# EAGLE design usb2cmi_s3_disp (EAGLE 6.5.0)
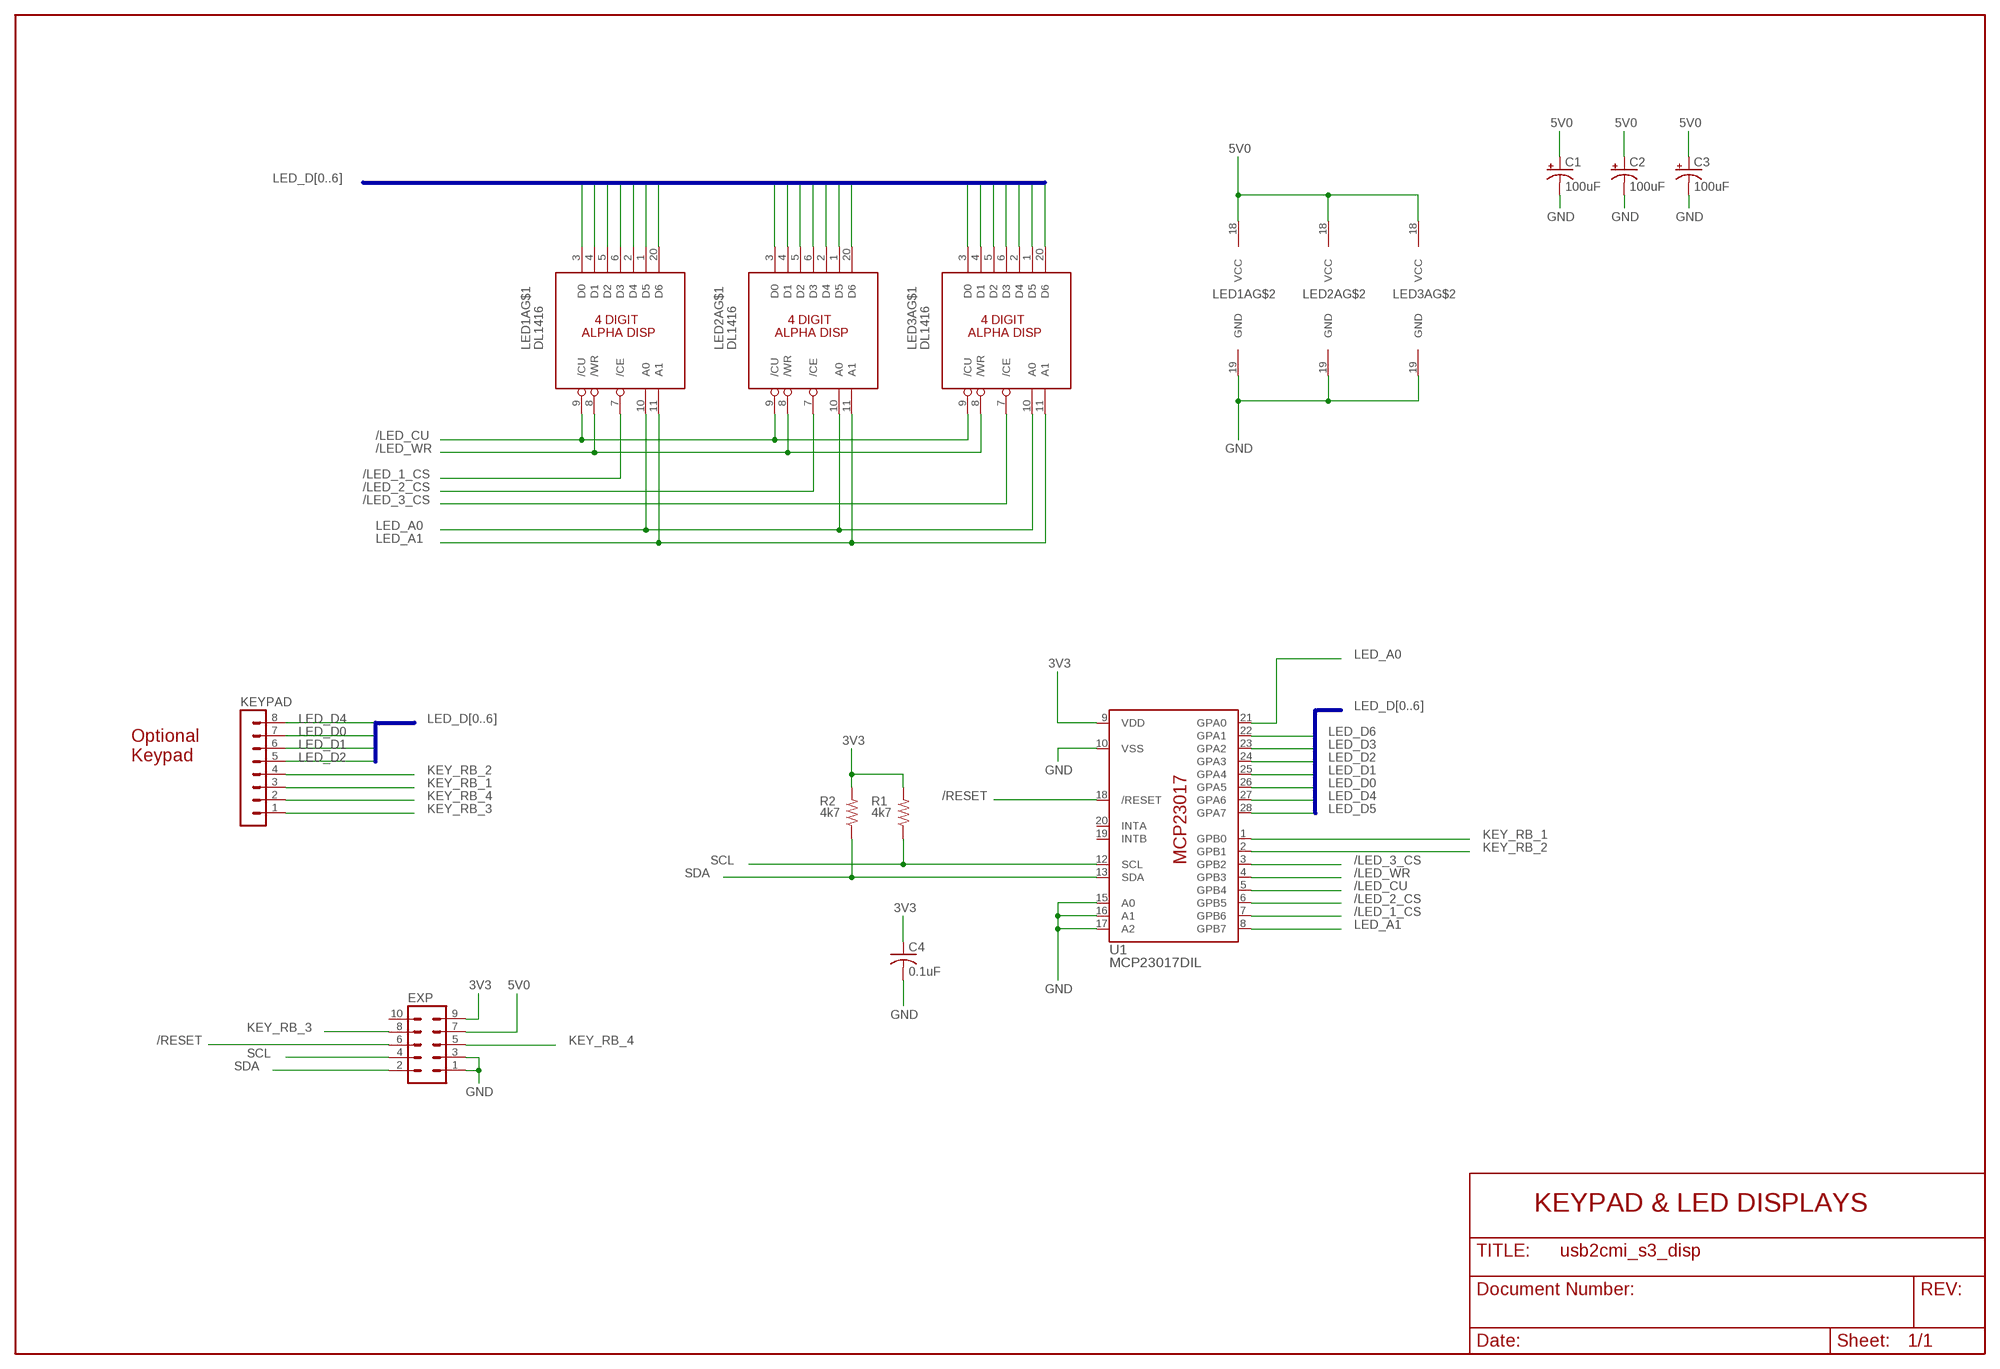
[diagram p0: schematic, sheet 1]

## Parts
C1  100uF  CPOL-USE2.5-7  [E2,5-7]
C2  100uF  CPOL-USE2.5-7  [E2,5-7]
C3  100uF  CPOL-USE2.5-7  [E2,5-7]
C4  0.1uF  C-US050-025X075  [C050-025X075]
EXP  MA05-2  [MA05-2]
KEYPAD  MA08-1  [MA08-1]
LED1A  DL1416  [DIL20]
LED2A  DL1416  [DIL20]
LED3A  DL1416  [DIL20]
R1  4k7  R-US_0207/10  [0207/10]
R2  4k7  R-US_0207/10  [0207/10]
U1  MCP23017DIL  [DIL28-3]

## Nets
3V3: C4.1 EXP.9 R1.2 R2.2 U1.9(VDD)
5V0: C1.+ C2.+ C3.+ EXP.7 LED1A.18(VCC) LED2A.18(VCC) LED3A.18(VCC)
/LED_1_CS: LED1A.7(/CE) U1.7(GPB6)
/LED_2_CS: LED2A.7(/CE) U1.6(GPB5)
/LED_3_CS: LED3A.7(/CE) U1.3(GPB2)
/LED_CU: LED1A.9(/CU) LED2A.9(/CU) LED3A.9(/CU) U1.5(GPB4)
/LED_WR: LED1A.8(/WR) LED2A.8(/WR) LED3A.8(/WR) U1.4(GPB3)
/RESET: EXP.6 U1.18(/RESET)
GND: C1.- C2.- C3.- C4.2 EXP.1 EXP.3 LED1A.19(GND) LED2A.19(GND) LED3A.19(GND) U1.10(VSS) U1.15(A0) U1.16(A1) U1.17(A2)
KEY_RB_1: KEYPAD.3 U1.1(GPB0)
KEY_RB_2: KEYPAD.4 U1.2(GPB1)
KEY_RB_3: EXP.8 KEYPAD.1
KEY_RB_4: EXP.5 KEYPAD.2
LED_A0: LED1A.10(A0) LED2A.10(A0) LED3A.10(A0) U1.21(GPA0)
LED_A1: LED1A.11(A1) LED2A.11(A1) LED3A.11(A1) U1.8(GPB7)
LED_D0: KEYPAD.7 LED1A.3(D0) LED2A.3(D0) LED3A.3(D0) U1.26(GPA5)
LED_D1: KEYPAD.6 LED1A.4(D1) LED2A.4(D1) LED3A.4(D1) U1.25(GPA4)
LED_D2: KEYPAD.5 LED1A.5(D2) LED2A.5(D2) LED3A.5(D2) U1.24(GPA3)
LED_D3: LED1A.6(D3) LED2A.6(D3) LED3A.6(D3) U1.23(GPA2)
LED_D4: KEYPAD.8 LED1A.2(D4) LED2A.2(D4) LED3A.2(D4) U1.27(GPA6)
LED_D5: LED1A.1(D5) LED2A.1(D5) LED3A.1(D5) U1.28(GPA7)
LED_D6: LED1A.20(D6) LED2A.20(D6) LED3A.20(D6) U1.22(GPA1)
SCL: EXP.4 R1.1 U1.12(SCL)
SDA: EXP.2 R2.1 U1.13(SDA)
Unconnected: EXP.10 U1.19(INTB) U1.20(INTA)

## Buses
LED_D[0..6]

## Notes on the sheet
- Optional
  Keypad
- KEYPAD & LED DISPLAYS

## Library data of the parts
C1-C3 = rcl:CPOL-US: POLARIZED CAPACITOR, American symbol
C4 = rcl:C-US: CAPACITOR, American symbol
EXP = con-lstb:MA05-2: PIN HEADER; OC_FARNELL: unknown; OC_NEWARK: unknown
KEYPAD = con-lstb:MA08-1: PIN HEADER; OC_FARNELL: unknown; OC_NEWARK: unknown
LED1A LED2A LED3A = led-siemens:DL1416
R1 R2 = rcl:R-US_: RESISTOR, American symbol
U1 = microchip-23016:MCP23017

## Board
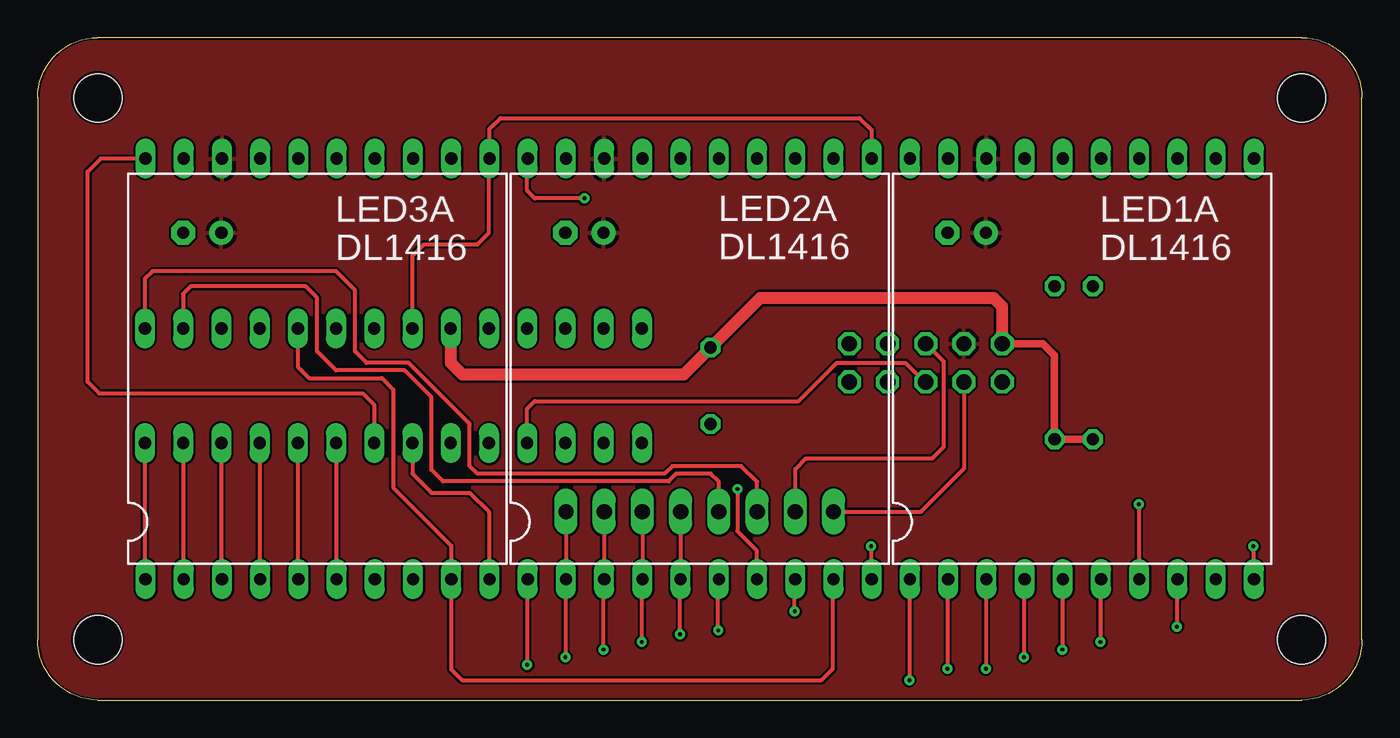
[diagram p1: board, top side]
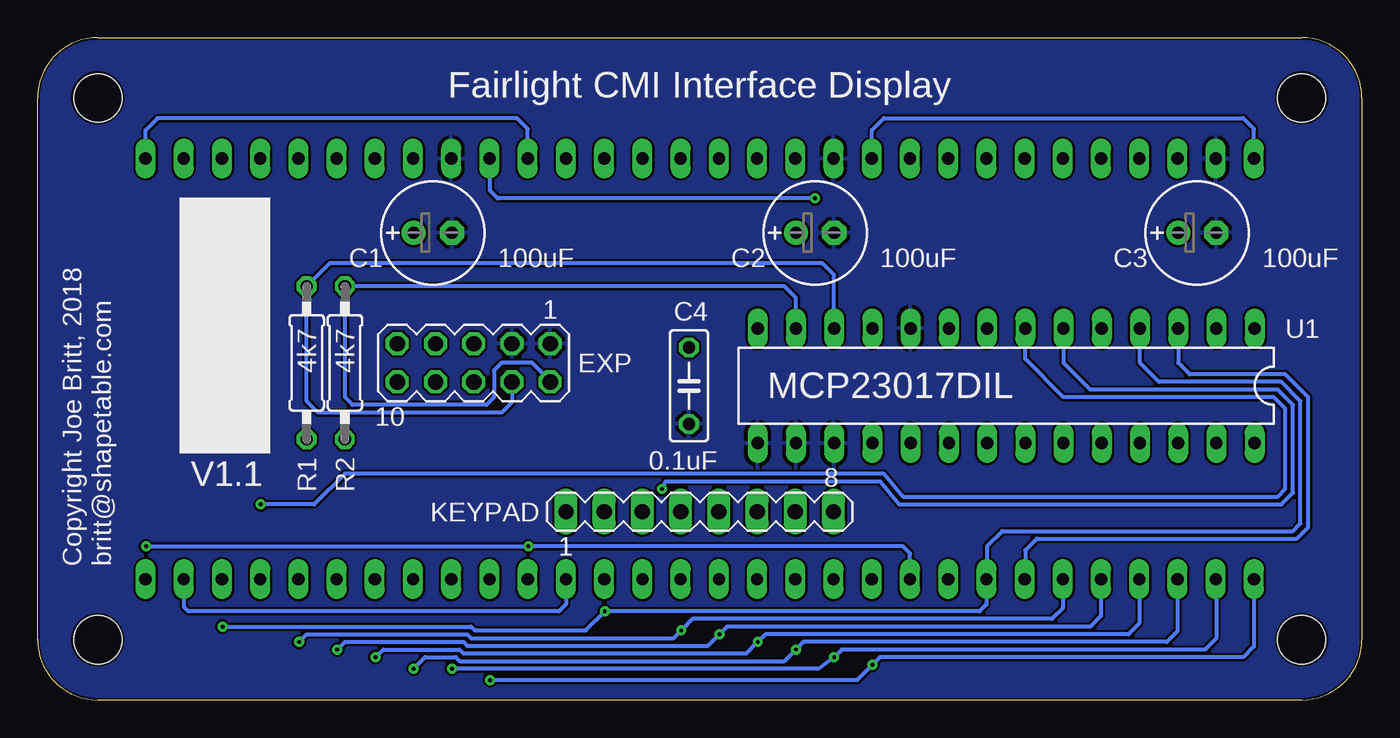
[diagram p2: board, bottom side, seen from below]

Size 88 x 44 mm. Coordinates in mm from the lower left corner, seen from the top.
Outline: 4,0 84,0 arc90 88,4 88,40 arc90 84,44 4,44 arc90 0,40 0,4 arc90 4,0
Copper layers (1*16): Top 0.035mm / dielectric 1.5mm / Bottom 0.035mm
Design rules "default *": minimum track width 6mil, minimum drill 10mil, track to track 6mil, track to pad 6mil, pad to pad 6mil, via to via 6mil, smd to smd 6mil, copper to edge 6mil, drill to drill 6mil, minimum pad ring 10mil, minimum via ring 8mil, stop-mask expansion 4mil, vias tented up to drill 10mil, thermal gap 10mil
Holes 3.2 mm at 4,40 84,40 84,4 4,4

### Footprints (pad centres in the part's own frame; a part is rotated, then mirrored left to right if it is on the bottom)
E2,5-7 = drill 0.813 pad 1.6: + -1.27,0 | drill 0.813 pad 1.6 octagon: - 1.27,0
C050-025X075 = drill 0.813 octagon: 1 -2.54,0; 2 2.54,0
MA05-2 = drill 1.016 octagon: 1 -5.08,-1.27; 2 -5.08,1.27; 3 -2.54,-1.27; 4 -2.54,1.27; 5 0,-1.27; 6 0,1.27; 7 2.54,-1.27; 8 2.54,1.27; 9 5.08,-1.27; 10 5.08,1.27
MA08-1 = drill 1.016 long: 1 -8.89,0; 2 -6.35,0; 3 -3.81,0; 4 -1.27,0; 5 1.27,0; 6 3.81,0; 7 6.35,0; 8 8.89,0
DIL20 = drill 0.813 long: 1 -11.43,-13.97; 2 -8.89,-13.97; 3 -6.35,-13.97; 4 -3.81,-13.97; 5 -1.27,-13.97; 6 1.27,-13.97; 7 3.81,-13.97; 8 6.35,-13.97; 9 8.89,-13.97; 10 11.43,-13.97; 11 11.43,13.97; 12 8.89,13.97; 13 6.35,13.97; 14 3.81,13.97; 15 1.27,13.97; 16 -1.27,13.97; 17 -3.81,13.97; 18 -6.35,13.97; 19 -8.89,13.97; 20 -11.43,13.97
0207/10 = drill 0.813 octagon: 1 -5.08,0; 2 5.08,0
DIL28-3 = drill 0.813 long: 1 -15.24,-3.81; 2 -12.7,-3.81; 3 -10.16,-3.81; 4 -7.62,-3.81; 5 -5.08,-3.81; 6 -2.54,-3.81; 7 0,-3.81; 8 2.54,-3.81; 9 5.08,-3.81; 10 7.62,-3.81; 11 10.16,-3.81; 12 12.7,-3.81; 13 15.24,-3.81; 14 17.78,-3.81; 15 17.78,3.81; 16 15.24,3.81; 17 12.7,3.81; 18 10.16,3.81; 19 7.62,3.81; 20 5.08,3.81; 21 2.54,3.81; 22 0,3.81; 23 -2.54,3.81; 24 -5.08,3.81; 25 -7.62,3.81; 26 -10.16,3.81; 27 -12.7,3.81; 28 -15.24,3.81

### Placement (x,y rotation side)
C1  61.74,31.04 0 bottom
C2  36.34,31.04 0 bottom
C3  10.94,31.04 0 bottom
C4  44.72,20.88 270 bottom
EXP  59.02,22.4 180 bottom
KEYPAD  44,12.51 0 bottom
LED1A  69.4,22 0 top
LED2A  44,22 0 top
LED3A  18.6,22 0 top
R1  70.12,22.4 270 bottom
R2  67.58,22.4 270 bottom
U1  22.37,20.88 180 bottom

### Tracks (layer width: path | path; a pad name or v marks a point on that pad's centre or on a via)
3V3
  Top 0.508: EXP.9 66.82,23.67 67.58,22.91 R2.2 R1.2
  Top 0.813: U1.9 27.45,22.4 28.21,21.64 42.94,21.64 C4.1 48.02,26.72 63.52,26.72 64.1,26.13 EXP.9
5V0
  pour Top: 0,44 88,44 88,0 0,0
/LED_1_CS  (via drill 0.25)
  Top 0.254: v73.17,13 73.17,8.07 LED1A.7
  Bottom 0.254: v73.17,13 69.61,13 67.58,15.03 31.77,15.03 30.5,13.51 5.6,13.51 5.1,14.02 5.1,19.35 5.86,20.11 19.83,20.11 22.37,22.65 U1.7
/LED_2_CS  (via drill 0.25)
  Top 0.254: v46.5,14.02 46.5,11.22 47.77,9.95 47.77,8.07 LED2A.7
  Bottom 0.254: U1.6 19.83,22.4 18.05,20.62 5.6,20.62 4.59,19.61 4.59,13.76 5.35,13 30.75,13 32.02,14.53 46.24,14.53 v46.5,14.02
/LED_3_CS
  Bottom 0.254: U1.3 12.21,22.4 11.45,21.64 5.1,21.64 3.57,20.11 3.57,11.48 4.33,10.72 21.61,10.72 22.37,9.95 22.37,8.07 LED3A.7
/LED_CU
  Top 0.254: U1.5 17.29,22.15 18.05,21.38 22.88,21.38 23.64,20.62 23.64,14.1 27.49,10.25 LED3A.9 27.49,2.04 28.21,1.32 52.09,1.32 52.85,2.08 52.85,7.99 LED2A.9
  Bottom 0.254: LED2A.9 52.89,6.36 53.36,5.89 77.99,5.89 78.29,6.19 LED1A.9
/LED_WR  (via drill 0.25)
  Top 0.254: v50.31,5.89 50.31,7.99 LED2A.8 | LED1A.8 75.71,7.99 v75.71,4.87
  Bottom 0.254: v75.71,4.87 59.2,4.87 58.94,4.62 51.58,4.62 v50.31,5.89 25.42,5.89 24.95,6.36 LED3A.8 24.91,8.07 24.91,10.21 23.89,11.22 4.59,11.22 4.08,11.73 4.08,19.86 5.35,21.13 13.48,21.13 14.75,22.4 U1.4
/RESET
  Top 0.254: EXP.6 58.77,21.31 57.67,22.4 53.1,22.4 50.56,19.86 33.04,19.86 32.53,19.35 U1.18
GND
  pour Bottom: 0,44 88,44 88,0 0,0
KEY_RB_1
  Top 0.254: KEYPAD.3 47.81,14.48 46.75,15.54 42.18,15.54 41.67,15.03 29.23,15.03 28.72,15.54 28.72,18.34 24.65,22.4 21.86,22.4 21.1,23.16 21.1,27.23 19.83,28.5 7.64,28.5 7.13,27.99 U1.1
KEY_RB_2
  Top 0.254: KEYPAD.4 45.27,14.48 44.72,15.03 42.43,15.03 41.93,14.53 26.94,14.53 26.18,15.29 26.18,20.11 24.4,21.89 19.83,21.89 18.56,23.16 18.56,26.72 17.8,27.48 10.18,27.48 9.67,26.97 U1.2
KEY_RB_3
  Top 0.254: KEYPAD.1 58.7,12.51 61.56,15.36 EXP.8
KEY_RB_4
  Top 0.254: KEYPAD.2 50.35,15.33 51.07,16.05 59.45,16.05 60.21,16.81 60.21,22.48 EXP.5
LED_A0  (via drill 0.25)
  Top 0.254: v55.39,10.21 55.39,8.07 LED2A.10 | LED1A.10 80.83,10.17 v80.79,10.21 | LED3A.10 29.99,8.07 29.99,12.49 28.72,13.76 26.18,13.76 24.91,15.03 U1.21
  Bottom 0.254: LED3A.10 30.03,9.74 30.5,10.21 v55.39,10.21 v80.79,10.21
LED_A1
  Top 0.254: LED2A.11 55.43,37.85 54.63,38.66 30.75,38.66 30.03,37.94 LED3A.11 29.99,35.93 29.99,31.04 29.23,30.27 25.67,30.27 24.91,29.51 U1.8
  Bottom 0.254: LED2A.11 55.43,37.94 56.15,38.66 80.03,38.66 80.83,37.85 LED1A.11
LED_D0  (via drill 0.25)
  Top 0.254: v37.61,3.35 37.61,7.99 LED2A.3 KEYPAD.7 | LED1A.3 63.01,7.99 v63.01,2.08 | U1.26 12.21,8.07 LED3A.3
  Bottom 0.254: LED3A.3 12.25,4.58 12.97,3.86 37.1,3.86 v37.61,3.35 38.37,2.59 59.96,2.59 60.21,2.84 62.25,2.84 v63.01,2.08
LED_D1  (via drill 0.25)
  Top 0.254: v40.15,3.86 40.15,7.99 LED2A.4 KEYPAD.6 | LED1A.4 65.55,7.99 v65.55,2.84 | U1.25 14.75,8.07 LED3A.4
  Bottom 0.254: LED3A.4 14.79,5.09 15.51,4.37 39.64,4.37 v40.15,3.86 40.91,3.1 59.71,3.1 59.96,3.35 65.04,3.35 v65.55,2.84
LED_D2  (via drill 0.25)
  Top 0.254: v42.69,4.37 42.69,7.99 LED2A.5 KEYPAD.5 | LED1A.5 68.09,7.99 v68.09,3.35 | U1.24 17.29,8.07 LED3A.5
  Bottom 0.254: LED3A.5 17.33,5.59 18.05,4.87 42.18,4.87 v42.69,4.37 43.45,3.6 59.45,3.6 59.71,3.86 67.58,3.86 v68.09,3.35
LED_D3  (via drill 0.25)
  Top 0.254: v45.23,4.62 45.23,7.99 LED2A.6 | LED1A.6 70.63,7.99 v70.63,3.86 | U1.23 19.83,8.07 LED3A.6
  Bottom 0.254: LED3A.6 19.87,6.1 20.59,5.38 44.47,5.38 v45.23,4.62 45.74,4.11 59.2,4.11 59.45,4.37 70.12,4.37 v70.63,3.86
LED_D4  (via drill 0.25)
  Top 0.254: LED1A.2 60.47,7.99 v60.47,2.08 | v35.07,2.84 35.07,7.99 LED2A.2 KEYPAD.8 | U1.27 9.67,8.07 LED3A.2
  Bottom 0.254: LED3A.2 9.67,7.99 9.67,4.11 10.43,3.35 34.56,3.35 v35.07,2.84 36.08,2.08 v60.47,2.08
LED_D5  (via drill 0.25)
  Top 0.254: LED1A.1 57.93,7.99 v57.93,1.32 | LED2A.1 32.53,7.99 v32.53,2.33 | U1.28 7.13,8.07 LED3A.1
  Bottom 0.254: LED3A.1 7.17,3.56 7.89,2.84 32.02,2.84 v32.53,2.33 33.54,1.32 v57.93,1.32
LED_D6  (via drill 0.25)
  Top 0.254: U1.22 22.37,19.61 21.61,20.37 4.08,20.37 3.32,21.13 3.32,35.1 4.19,35.97 LED3A.20 | v36.34,33.32 33.04,33.32 32.53,33.83 32.53,35.93 LED2A.20
  Bottom 0.254: LED3A.20 7.17,37.94 7.89,38.66 31.77,38.66 32.57,37.85 LED2A.20 | v36.34,33.32 57.42,33.32 57.93,33.83 57.93,35.93 LED1A.20
SCL
  Bottom 0.254: U1.12 35.07,28.24 35.83,29 68.6,29 R1.1 70.12,19.86 69.36,19.1 57.17,19.1 56.48,19.78 EXP.4
SDA
  Bottom 0.254: U1.13 37.61,26.72 38.37,27.48 R2.1 67.58,20.11 67.07,19.61 58.18,19.61 57.67,20.11 57.67,21.89 57.17,22.4 55.13,22.4 53.94,21.21 EXP.2

### Text on the board
bPlace: Fairlight CMI Interface Display | V1.1 | britt@shapetable.com | Copyright Joe Britt, 2018